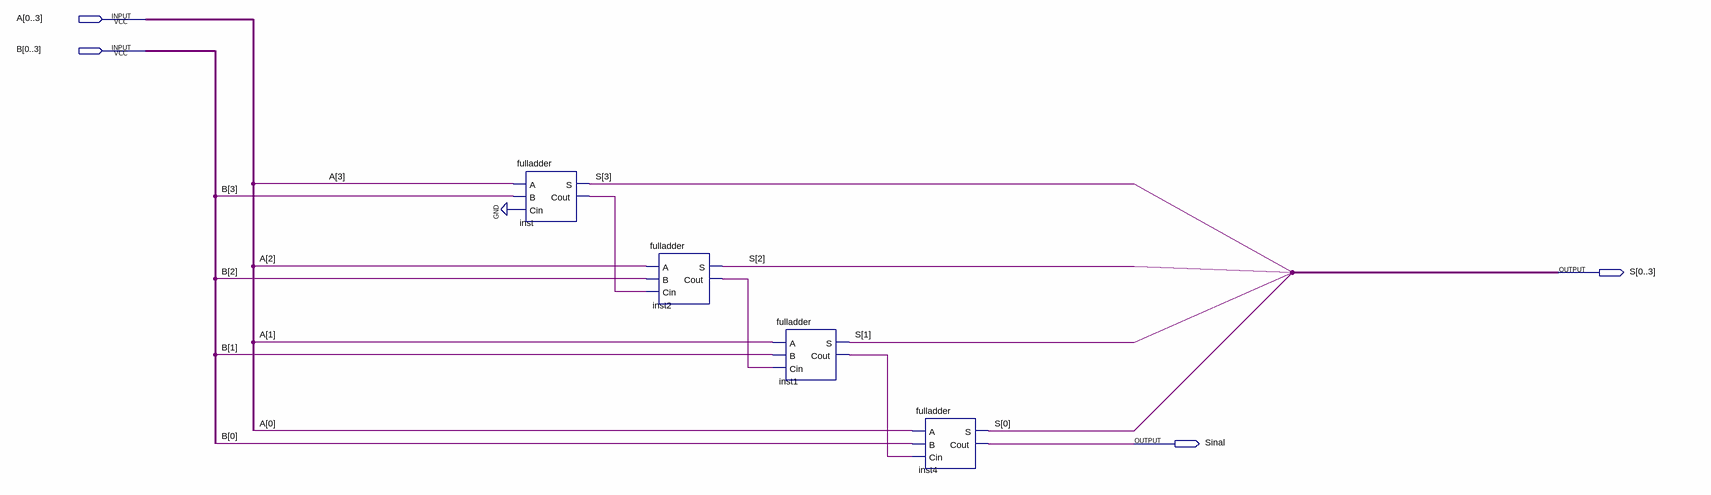
[diagram p0: schematic sheet]
// Quartus schematic adder4bits.bdf as structural Verilog: 4 symbols, 4 pins
module adder4bits (
  input  [0:3] A,
  input  [0:3] B,
  output [0:3] S,
  output Sinal
);

  wire inst1_cout, inst2_cout, inst_cout;

  fulladder inst (.A(A[3]), .B(B[3]), .Cin(1'b0), .S(S[3]), .Cout(inst_cout));
  fulladder inst2 (.A(A[2]), .B(B[2]), .Cin(inst_cout), .S(S[2]), .Cout(inst2_cout));
  fulladder inst1 (.A(A[1]), .B(B[1]), .Cin(inst2_cout), .S(S[1]), .Cout(inst1_cout));
  fulladder inst4 (.A(A[0]), .B(B[0]), .Cin(inst1_cout), .S(S[0]), .Cout(Sinal));
endmodule
